# EasyEDA Pro project FSR402.eprj

# Schematic FSR402_ADC
Board Name: FSR402_ADC; Create Date: 2025-05-05; Page Name: Sheet_1; Project Name: FSR402; Schematic Name: FSR402_ADC; Update Date: 2025-05-05; Add into BOM: yes; Company: Your Company; Convert to PCB: yes; Date: 2025-05-05; Draw By: zimin_jlc; REV: 1.0; Sheet: 1/1; spicePre: .
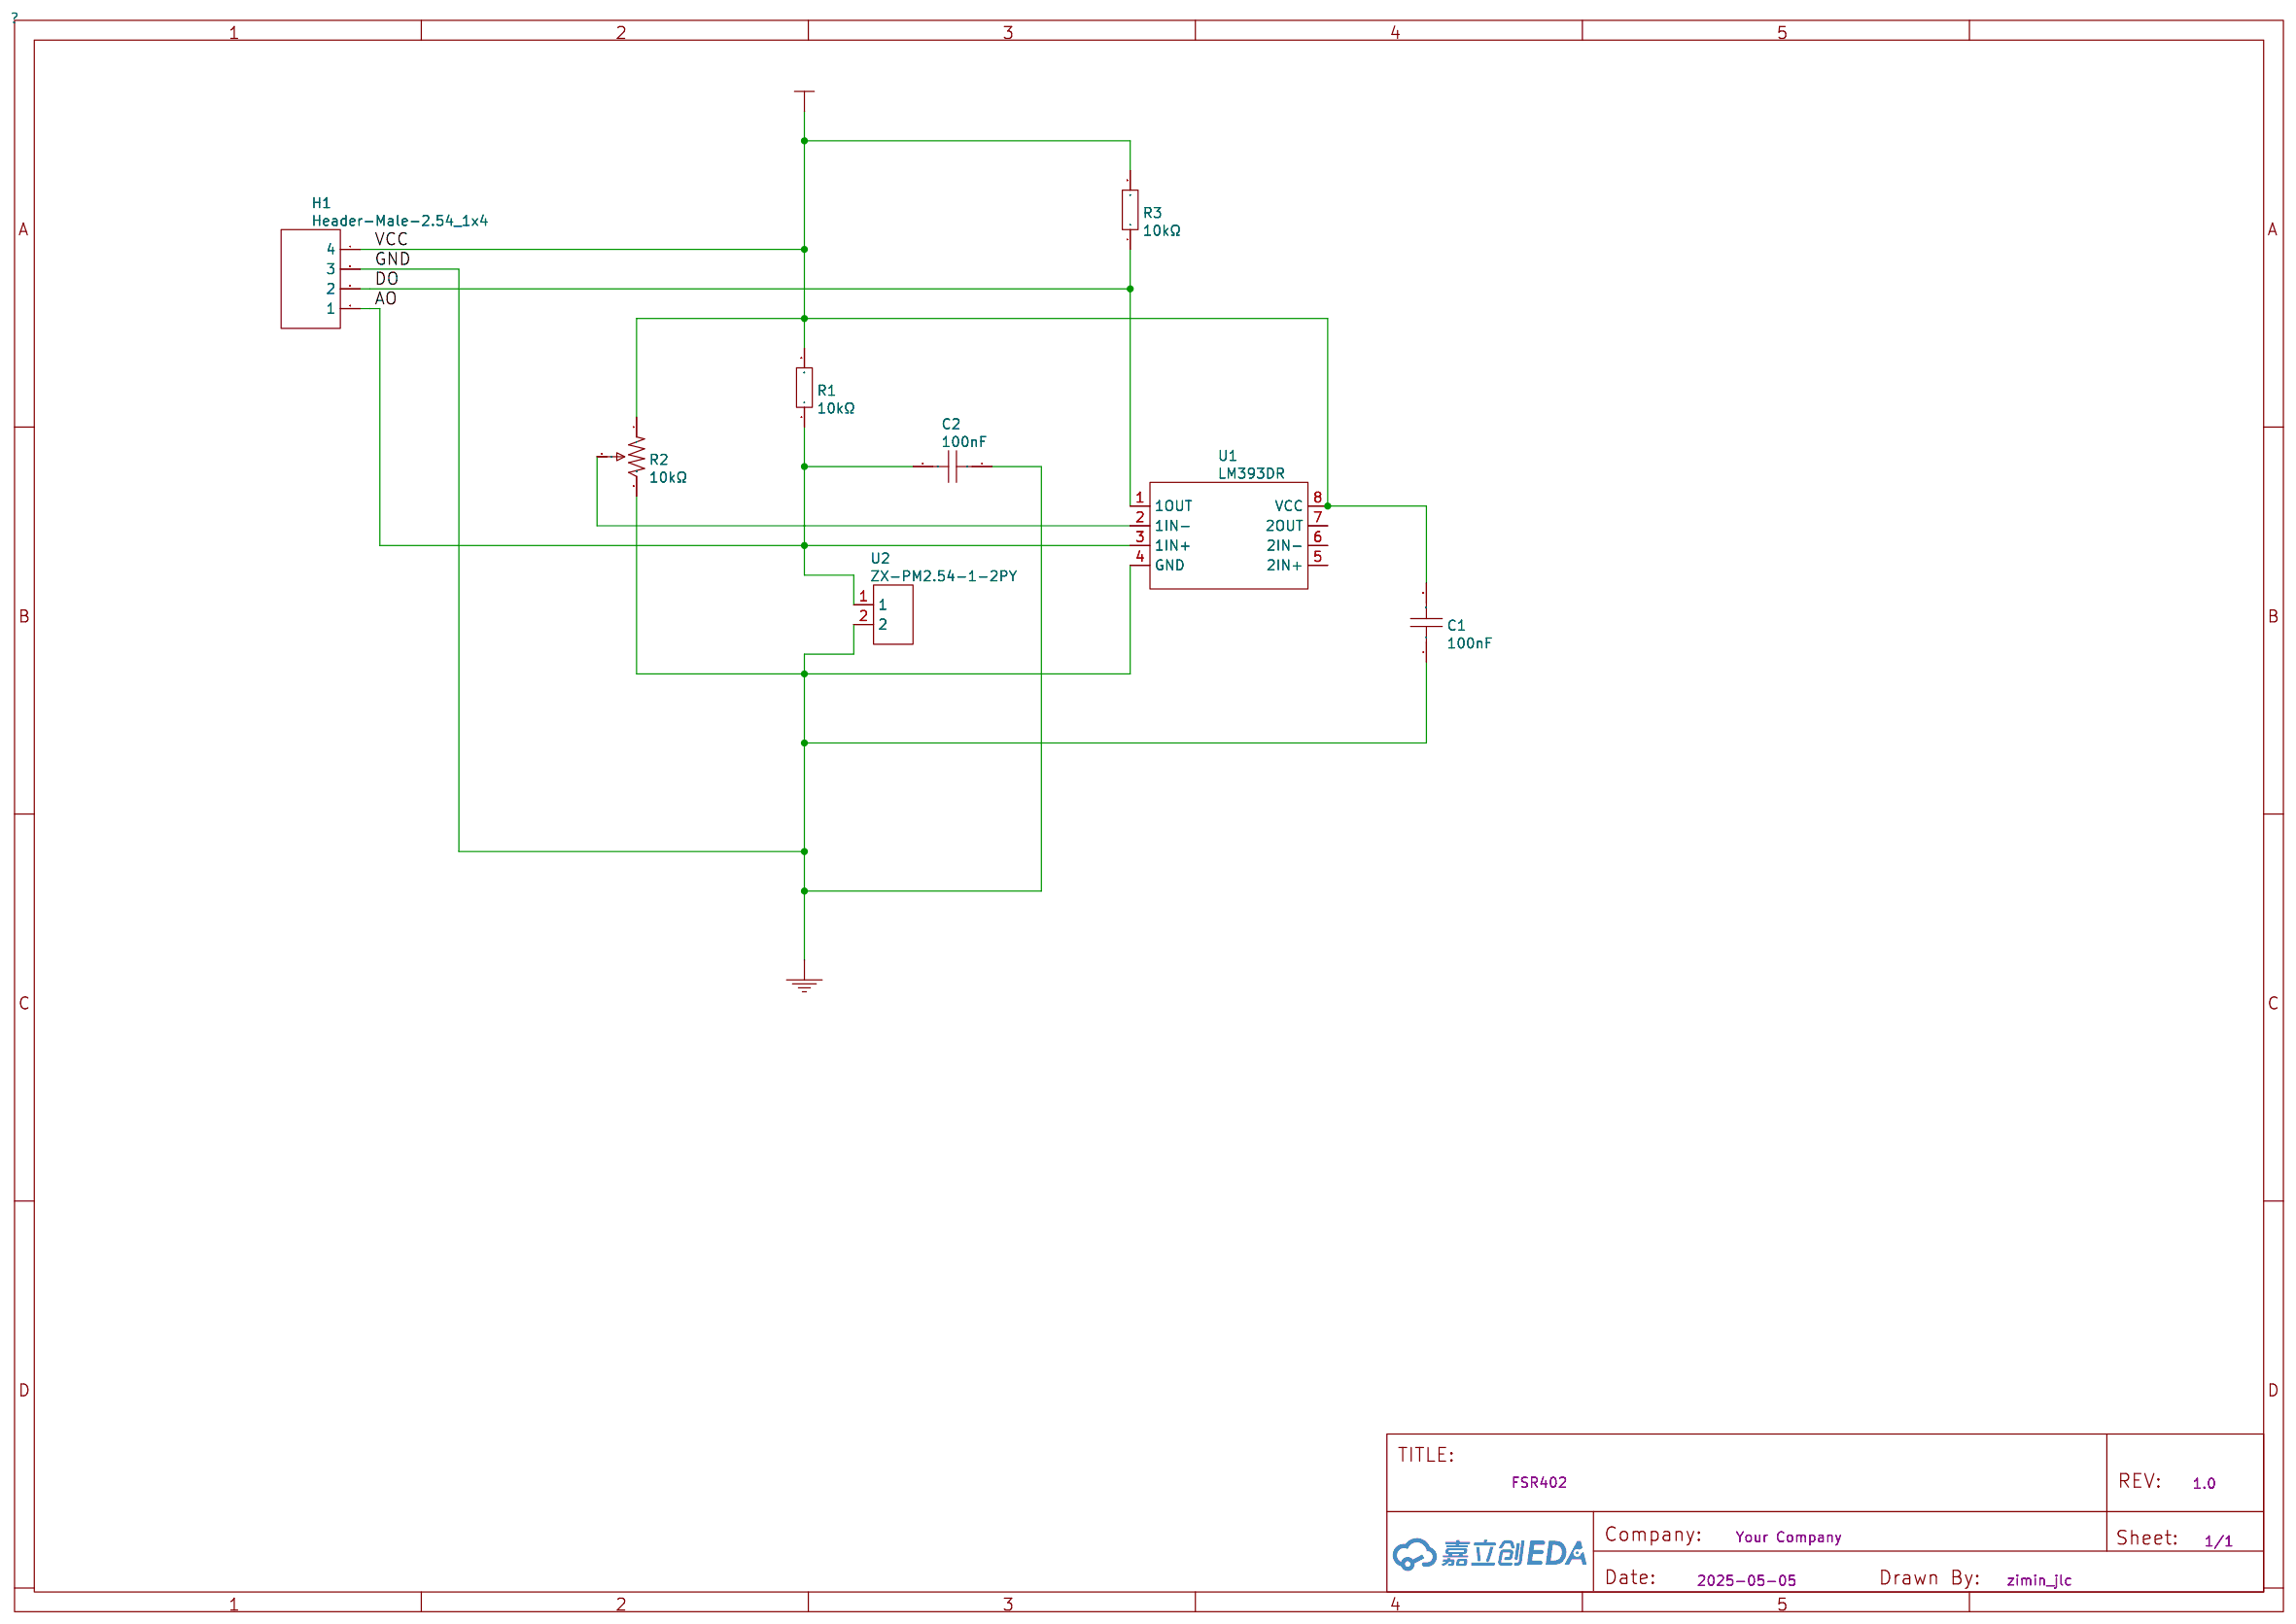
[diagram p0: schematic sheet]

## Parts
C1  100nF  [C0603]
C2  100nF  [C0603]
H1  Header-Male-2.54_1x4  [HDR-TH_4P-P2.54-V-M]
R1  10kΩ  [R0603]
R2  10kΩ  [RES-ADJ-TH_3362P]
R3  10kΩ  [R0603]
U1  LM393DR  [SOIC-8_L5.0-W4.0-P1.27-LS6.0-BL]
U2  ZX-PM2.54-1-2PY  [HDR-TH_2P-P2.54-V-F]

## Library data of the parts
C1 C2 = 100nF: Supplier: LCSC; Supplier Part: C6119867; Manufacturer: HRE(芯声); Manufacturer Part: CGA0603X7R104K500JT; JLCPCB Part Class: Extended Part; nameAlias: Value; Contributor: lcsc; spicePre: C; spiceSymbolName: CGA0603X7R104K500JT
H1 = Header-Male-2.54_1x4: Supplier: LCSC; Manufacturer: Ckmtw(灿科盟); Manufacturer Part: B-2100S04P-A110; Supplier Part: C124378; JLCPCB Part Class: Extended Part; Contributor: LCSC; spicePre: H
R1 R3 = 10kΩ: Supplier: LCSC; Manufacturer: UNI-ROYAL(厚声); Manufacturer Part: 0603WAF1002T5E; Supplier Part: C25804; JLCPCB Part Class: Basic Part; nameAlias: Value; spicePre: R; spiceSymbolName: 0603WAF1002T5E
R2 = 10kΩ: Resistance: 10K; Supplier: LCSC; Supplier Part: C118956; Manufacturer: BOCHEN(博晨); Manufacturer Part: 3362P-1-103; JLCPCB Part Class: Extended Part; nameAlias: Value; Contributor: LCSC; spicePre: R; spiceSymbolName: 3362P-1-103_C118956
U1 = LM393DR: Supplier: LCSC; Manufacturer: TI(德州仪器); Supplier Part: C67470; JLCPCB Part Class: Extended Part; spicePre: X
U2 = ZX-PM2.54-1-2PY: Supplier: LCSC; Supplier Part: C7499322; Manufacturer: Megastar(兆星); JLCPCB Part Class: Extended Part; Contributor: lcsc; spicePre: U

## Nets
GND: C1.1 C2.1 H1.3 R2.3 U1.4(GND) U2.2
VCC: C1.2 H1.4 R1.2 R2.1 R3.2 U1.8(VCC)
AO: C2.2 H1.1 R1.1 U1.3(1IN+) U2.1
DO: H1.2 R3.1 U1.1(1OUT)
Net-(R2-2): R2.2 U1.2(1IN-)

Not connected (* = marked no-connect by the designer): U1 5(2IN+) 6(2IN-) 7(2OUT)

# Board 1-PCB_PCB_FSR402_ADC_2
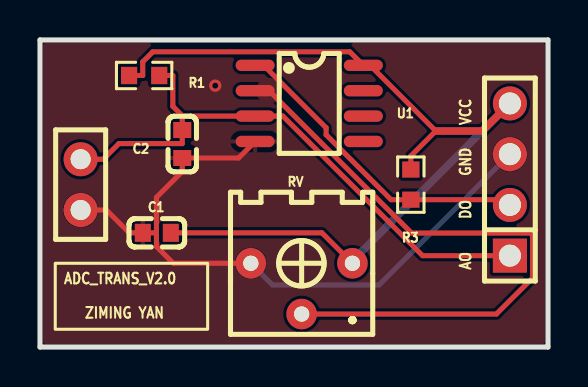
[diagram p1: board, top side]
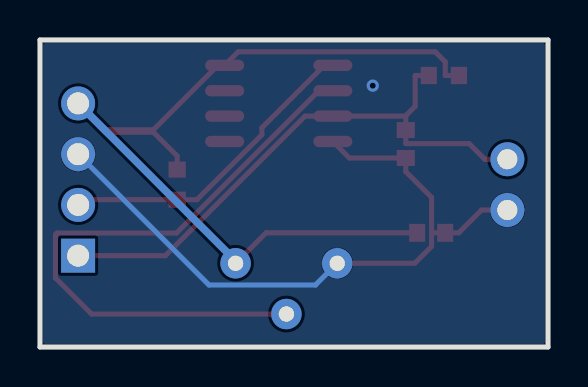
[diagram p2: board, bottom side, seen from below]

Outline 25.4 x 15.37 mm; copper layers: Top Layer, Bottom Layer. Coordinates in mm from the lower left corner of the outline.
Outline path: 0,15.37 25.4,15.37 25.4,0 0,0 0,15.37
Stack: Top Layer 0.035mm / Dielectric1 1.51mm FR4 er 4.5 / Bottom Layer 0.035mm

## Design rules (mm)
spacing Default (default): track to track 0.152, other pairs 0 to 0.152
track width Default (default): min 0.254, default 0.254, max 25.4
differential pair differentialPair (default): width min 0.127, default 0.254, max 2.54; gap min 0.152, default 0.152
via Default (default): diameter min 0.61, default 0.61, max 100.025; hole min 0.305, default 0.305, max 59.995

## Placement (name value [footprint] x y rotation side)
C1  100nF  [C0603]  5.84 5.71 0 top
C2  100nF  [C0603]  7.11 10.16 90 top
H1  Header-Male-2.54_1x4  [HDR-TH_4P-P2.54-V-M]  23.5 8.38 90 top
R1  10kΩ  [R0603]  5.21 13.59 180 top
R3  10kΩ  [R0603]  18.54 8.13 90 top
RV  10kΩ  [RES-ADJ-TH_3362P]  13.08 2.92 180 top
U1  LM393DR  [SOIC-8_L5.0-W4.0-P1.27-LS6.0-BL]  13.46 12.19 270 top
U2  ZX-PM2.54-1-2PY  [HDR-TH_2P-P2.54-V-F]  2.03 8.13 270 top

## Footprints (pads in the part's own frame, mm; a bottom-side part is the same pattern mirrored in y, then rotated)
C0603
  rect 0.8x0.9 smd: 1(-0.7,0) 2(0.7,0)
HDR-TH_2P-P2.54-V-F
  round 1.7 hole 1: 1(-1.27,0) 2(1.27,0)
HDR-TH_4P-P2.54-V-M
  rect 1.7x1.7 hole 1.1: 1(-3.81,0)
  round 1.7 hole 1.1: 2(-1.27,0) 3(1.27,0) 4(3.81,0)
R0603
  rect 0.806x0.864 smd: 1(-0.753,0) 2(0.753,0)
RES-ADJ-TH_3362P
  round 1.524 hole 0.762: 1(-2.54,-1.27) 2(0,1.27) 3(2.54,-1.27)
SOIC-8_L5.0-W4.0-P1.27-LS6.0-BL
  oval 0.569x1.95 smd: 1(-1.905,-2.705) 2(-0.635,-2.705) 3(0.635,-2.705) 4(1.905,-2.705) 5(1.905,2.705) 6(0.635,2.705) 7(-0.635,2.705) 8(-1.905,2.705)

## Nets
GND: C1.1 C2.1 H1.3 RV.3 U1.4 U2.2
VCC: C1.2 H1.4 R1.2 R3.2 RV.1 U1.8
AO: C2.2 H1.1 R1.1 U1.3 U2.1
DO: H1.2 R3.1 U1.1
U1_2: RV.2 U1.2
U1_5: U1.5
U1_6: U1.6
U1_7: U1.7

## Via types
v1: diameter 0.61, hole 0.305, Top Layer to Bottom Layer, 1 via

## Routing (per net, layer and track width the routed paths; a pad name or vN(x,y) marks a point on that pad's centre or on a via; arc(x,y) is an arc through that point)
GND: length 34.4
  Top Layer w0.254: 5.82,5.71 C1.1 4.46,5.71 3.32,6.86 U2.2 ; 5.82,5.71 5.82,5.04 6.67,4.19 RV.3 ; 5.82,5.71 5.82,7.49 7.11,8.78 C2.1 9.93,9.46 U1.4
  Bottom Layer w0.254: H1.3 16.95,3.1 11.63,3.1 RV.3
  vias: v1(8.76,13.08)
VCC: length 45.6
  Top Layer w0.254: C1.2 14.1,5.71 RV.1 ; R3.2 18.54,9.56 19.79,10.81 16.51,14.1 U1.8 15.49,14.77 5.64,14.77 5.14,14.27 5.14,13.59 R1.2
  Top Layer w0.381: H1.4 22.12,10.81 19.79,10.81
  Bottom Layer w0.381: H1.4 15.62,4.32 RV.1
AO: length 29
  Top Layer w0.254: 7.13,11.56 7.11,11.54 C2.2 7.11,10.18 3.94,10.18 3.16,9.4 U2.1 ; 7.13,11.56 U1.3 12.14,11.56 19.13,4.57 H1.1 ; 7.13,11.56 6.64,12.04 6.64,13.59 R1.1
DO: length 15.8
  Top Layer w0.254: U1.1 11.18,14.1 14.31,10.97 14.31,10.62 17.55,7.37 R3.1 23.23,7.37 H1.2
U1_2: length 31.3
  Top Layer w0.254: U1.2 11.45,12.83 18.58,5.7 24.55,5.7 24.63,5.63 24.63,3.46 22.82,1.65 RV.2

## Copper pours and planes (outline as drawn; the poured copper is in the pictures)
GND on Top Layer: 0.13,15.37 25.4,15.37 25.4,0.13 0.13,0.13
GND on Bottom Layer: 0.13,15.37 25.4,15.37 25.4,0.13 0.13,0.13

## Text on the board
Top Silkscreen Layer: ADC_TRANS_V2.0 / ZIMING YAN | VCC | GND | DO | AO
